# EAGLE design DigiCar (EAGLE 6.5.0)
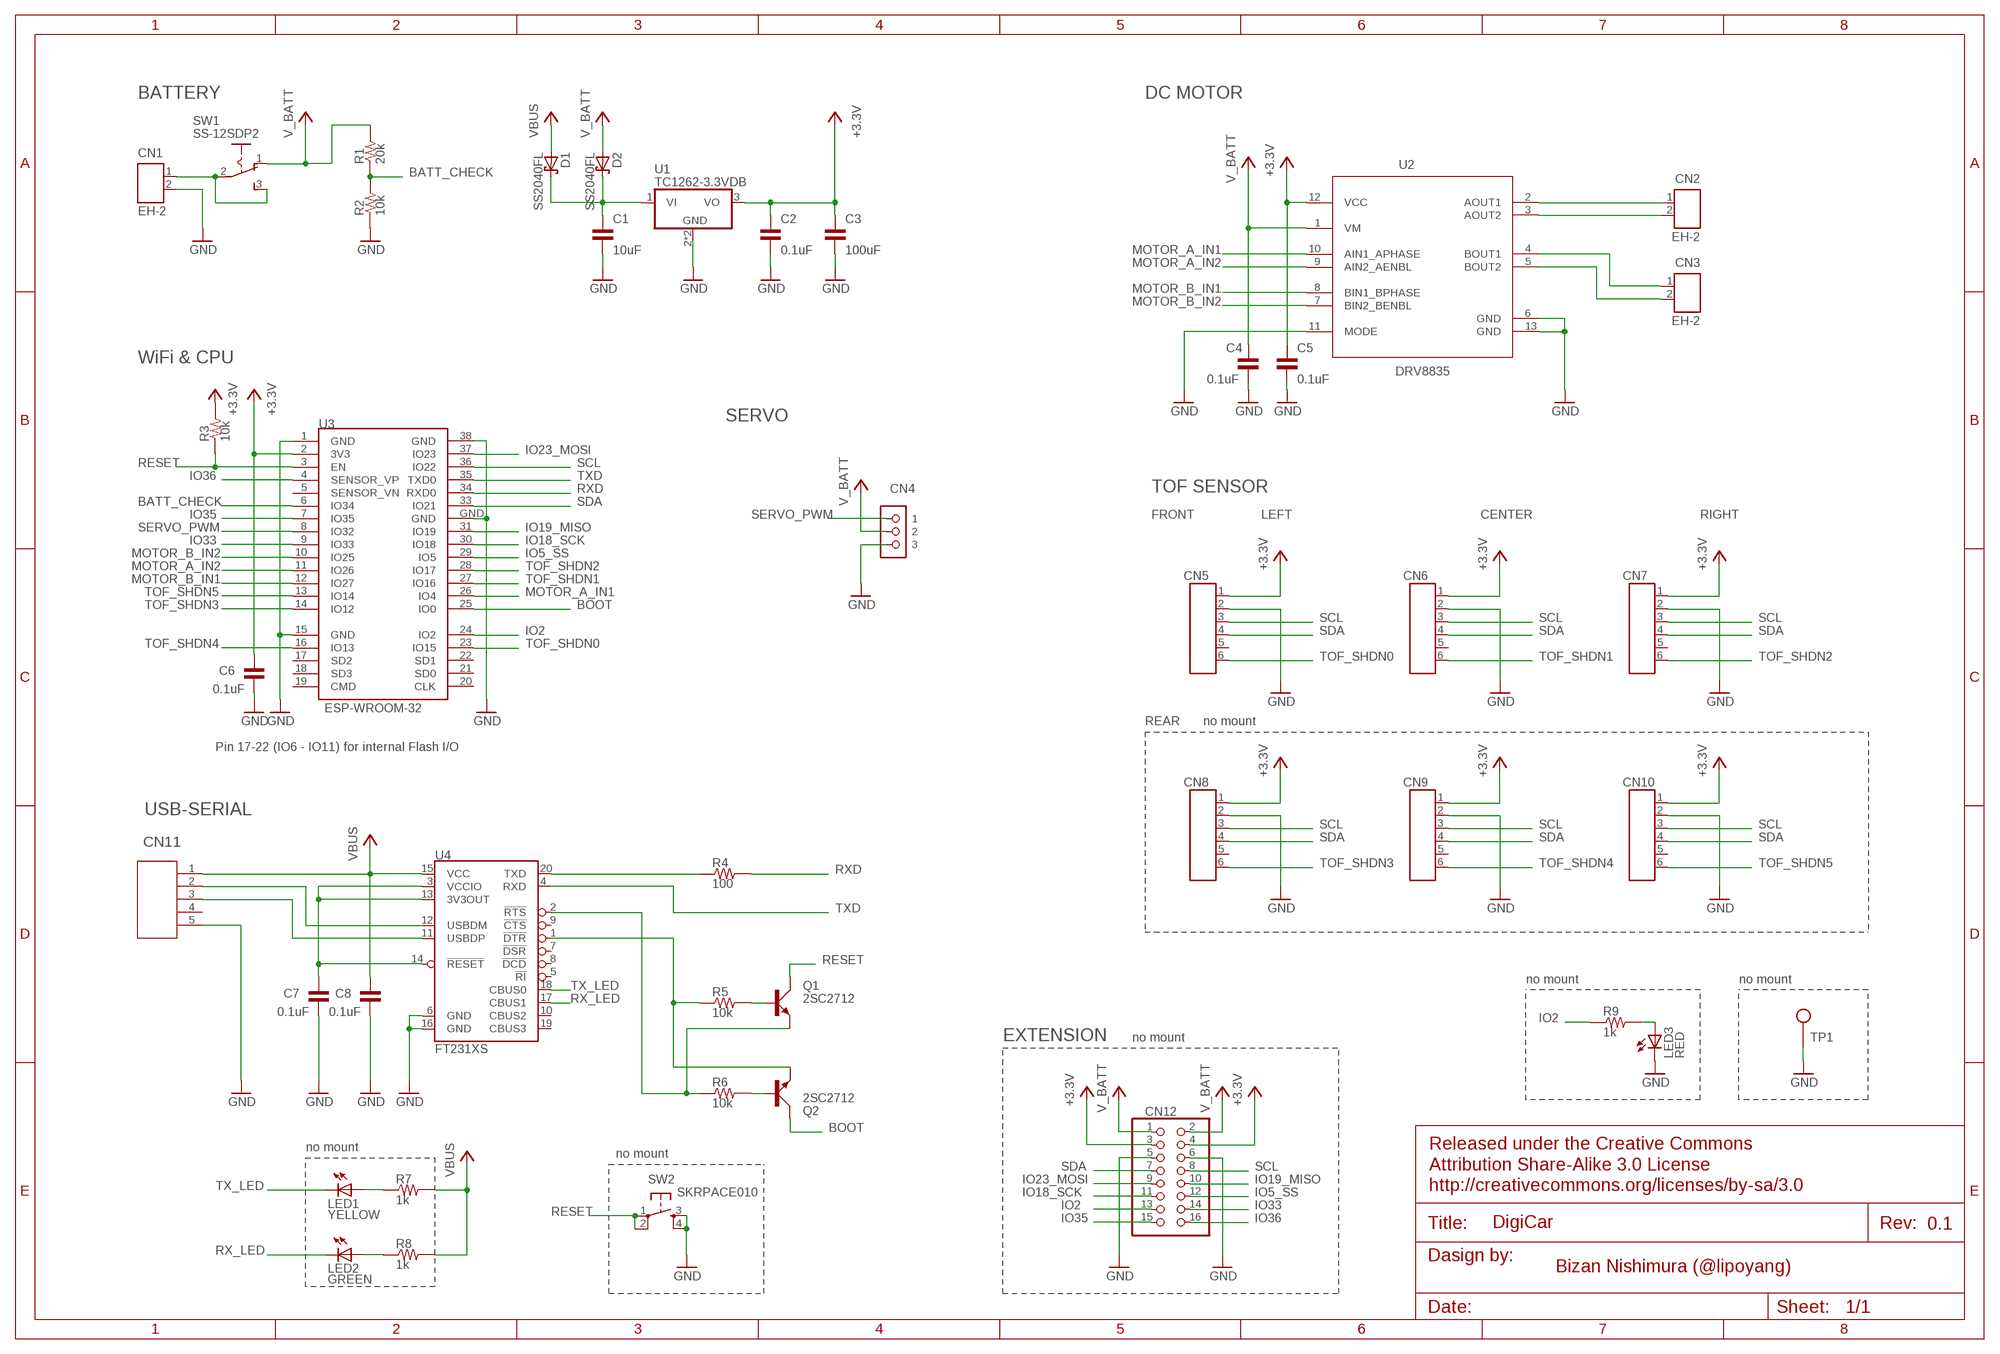
[diagram p0: schematic, sheet 1]

## Parts
C1  10uF  C-CP-3216  [CP3216]
C2  0.1uF  C-CP-1608  [CP1608]
C3  100uF  C-CP-3216  [CP3216]
C4  0.1uF  C-CP-1608  [CP1608]
C5  0.1uF  C-CP-1608  [CP1608]
C6  0.1uF  C-CP-1608  [CP1608]
C7  0.1uF  C-CP-1608  [CP1608]
C8  0.1uF  C-CP-1608  [CP1608]
CN1  EH-2  [EH-2]
CN2  EH-2  [EH-2]
CN3  EH-2  [EH-2]
CN4  PINHD-1X3  [CON_RC_SERVO]
CN5  PINHD-1X6  [1X06]
CN6  PINHD-1X6  [1X06]
CN7  PINHD-1X6  [1X06]
CN8  PINHD-1X6  [1X06]
CN9  PINHD-1X6  [1X06]
CN10  PINHD-1X6  [1X06]
CN11  ZX62-B-5PA(11)  [CONN_ZX62-B-5PA(11)_HIR]
CN12  PINHD-2X8  [2X08]
D1  SS2040FL  SCHOTTKY-DIODE-SOD123  [SOD123]
D2  SS2040FL  SCHOTTKY-DIODE-SOD123  [SOD123]
LED1  YELLOW  LED1608  [LED1608]
LED2  GREEN  LED1608  [LED1608]
LED3  RED  LED1608  [LED1608]
Q1  2SC2712  [SC59]
Q2  2SC2712  [SC59]
R1  20k  R-CP-1608  [CP1608]
R2  10k  R-CP-1608  [CP1608]
R3  10k  R-CP-1608  [CP1608]
R4  100  R-CP-1608  [CP1608]
R5  10k  R-CP-1608  [CP1608]
R6  10k  R-CP-1608  [CP1608]
R7  1k  R-CP-1608  [CP1608]
R8  1k  R-CP-1608  [CP1608]
R9  1k  R-CP-1608  [CP1608]
SW1  SS-12SDP2  M251  [SLIDE-SW]
SW2  SKRPACE010  [SKRPACE010]
TP1  TEST_PIN  [TEST_PIN]
U1  TC1262-3.3VDB  [SOT223]
U2  DRV8835  [DRV8835]
U3  ESP-WROOM-32  [ESP-WROOM-32]
U4  FT231XS  [SSOP20]

## Nets
+3V3: C2.SMD1(PIN1) C3.SMD1(PIN1) C5.SMD1(PIN1) C6.SMD1(PIN1) CN5.1 CN6.1 CN7.1 CN8.1 CN9.1 CN10.1 CN12.3 CN12.4 R3.SMD2(PIN2) U1.3(VO) U2.12(VCC) U3.2(3V3) ; supply symbol labelled +3.3V
BATT_CHECK: R1.SMD1(PIN1) R2.SMD2(PIN2) U3.6(IO34)
BOOT: Q2.C U3.25(IO0)
GND: C1.SMD2(PIN2) C2.SMD2(PIN2) C3.SMD2(PIN2) C4.SMD2(PIN2) C5.SMD2(PIN2) C6.SMD2(PIN2) C7.SMD2(PIN2) C8.SMD2(PIN2) CN1.2 CN4.3 CN5.2 CN6.2 CN7.2 CN8.2 CN9.2 CN10.2 CN11.5 CN12.5 CN12.6 LED3.C R2.SMD1(PIN1) SW2.3 SW2.4 TP1.1 U1.2(GND) U1.4(GND) U2.6(GND) U2.11(MODE) U2.13(GND) U3.1(GND) U3.15(GND) U3.38(GND) U3.GND U4.6(GND) U4.16(GND)
IO2: CN12.13 R9.SMD1(PIN1) U3.24(IO2)
IO5_SS: CN12.12 U3.29(IO5)
IO18_SCK: CN12.11 U3.30(IO18)
IO19_MISO: CN12.10 U3.31(IO19)
IO23_MOSI: CN12.9 U3.37(IO23)
IO33: CN12.14 U3.9(IO33)
IO35: CN12.15 U3.7(IO35)
IO36: CN12.16 U3.4(SENSOR_VP)
MOTOR_A_IN1: U2.10(AIN1_APHASE) U3.26(IO4)
MOTOR_A_IN2: U2.9(AIN2_AENBL) U3.11(IO26)
MOTOR_B_IN1: U2.8(BIN1_BPHASE) U3.12(IO27)
MOTOR_B_IN2: U2.7(BIN2_BENBL) U3.10(IO25)
N$1: CN1.1 SW1.2(P) SW1.3(S)
N$2: LED3.A R9.SMD2(PIN2)
N$3: C1.SMD1(PIN1) D1.C D2.C U1.1(VI)
N$7: R4.SMD1(PIN1) U4.20(TXD)
N$8: Q1.B R5.SMD2(PIN2)
N$12: Q2.B R6.SMD2(PIN2)
N$13: CN11.2 U4.12(USBDM)
N$14: CN11.3 U4.11(USBDP)
N$15: C7.SMD1(PIN1) U4.3(VCCIO) U4.13(3V3OUT) U4.14(!RESET)
N$16: Q2.E R5.SMD1(PIN1) U4.1(!DTR)
N$17: Q1.E R6.SMD1(PIN1) U4.2(!RTS)
N$18: CN2.1 U2.2(AOUT1)
N$19: CN2.2 U2.3(AOUT2)
N$20: LED1.A R7.SMD1(PIN1)
N$21: LED2.A R8.SMD1(PIN1)
N$22: CN3.1 U2.4(BOUT1)
N$23: CN3.2 U2.5(BOUT2)
RESET: Q1.C R3.SMD1(PIN1) SW2.1 SW2.2 U3.3(EN)
RX_LED: LED2.C U4.17(CBUS1)
RXD: R4.SMD2(PIN2) U3.34(RXD0)
SCL: CN5.3 CN6.3 CN7.3 CN8.3 CN9.3 CN10.3 CN12.8 U3.36(IO22)
SDA: CN5.4 CN6.4 CN7.4 CN8.4 CN9.4 CN10.4 CN12.7 U3.33(IO21)
SERVO_PWM: CN4.1 U3.8(IO32)
TOF_SHDN0: CN5.6 U3.23(IO15)
TOF_SHDN1: CN6.6 U3.27(IO16)
TOF_SHDN2: CN7.6 U3.28(IO17)
TOF_SHDN3: CN8.6 U3.14(IO12)
TOF_SHDN4: CN9.6 U3.16(IO13)
TOF_SHDN5: CN10.6 U3.13(IO14)
TX_LED: LED1.C U4.18(CBUS0)
TXD: U3.35(TXD0) U4.4(RXD)
V_BATT: C4.SMD1(PIN1) CN4.2 CN12.1 CN12.2 D2.A R1.SMD2(PIN2) SW1.1(O) U2.1(VM)
VBUS: C8.SMD1(PIN1) CN11.1 D1.A R7.SMD2(PIN2) R8.SMD2(PIN2) U4.15(VCC)
Unconnected: CN5.5 CN6.5 CN7.5 CN8.5 CN9.5 CN10.5 CN11.4 U3.5(SENSOR_VN) U3.17(SD2) U3.18(SD3) U3.19(CMD) U3.20(CLK) U3.21(SD0) U3.22(SD1) U4.5(!RI) U4.7(!DSR) U4.8(!DCD) U4.9(!CTS) U4.10(CBUS2) U4.19(CBUS3)

## Notes on the sheet
- BATTERY | DC MOTOR
- WiFi & CPU
- SERVO
- TOF SENSOR
- FRONT | LEFT | CENTER | RIGHT
- REAR | no mount
- Pin 17-22 (IO6 - IO11) for internal Flash I/O
- USB-SERIAL
- no mount | no mount
- EXTENSION | no mount
- no mount
- no mount
- 0.1
- Bizan Nishimura (@lipoyang)

## Library data of the parts
C1-C8 = lipoyang_cr:C-: CAPACITOR Japanese symbol
CN1-CN3 = lipoyang_mechanical:EH-2
CN4 = lipoyang_mechanical:PINHD-1X3: PIN HEADER
CN5-CN10 = lipoyang_mechanical:PINHD-1X6: PIN HEADER
CN11 = lipoyang_mechanical:ZX62-B-5PA(11); BUILT_BY: EMA_Cory; COPYRIGHT: Copyright (C) 2018 Accelerated Designs. All rights reserved; DATASHEET: https://media.digikey.com/pdf/Data%20Sheets/Hirose%20PDFs/ZX_Series.pdf; MANUFACTURER_PART_NUMBER: ZX62-B-5PA(11); SOURCELIBRARY: Hirose_2020-05-21; VENDOR: Hirose
CN12 = lipoyang_mechanical:PINHD-2X8: PIN HEADER
D1 D2 = lipoyang_discrete:SCHOTTKY-DIODE: Schottky Diode
LED1-LED3 = lipoyang_discrete:LED: LED
Q1 Q2 = lipoyang_discrete:2SC2712: High-Frequency Amplifier Transistor 11V, 50mA, 3.2GHz (Rohm)
R1-R9 = lipoyang_cr:R-: RESISTOR Japanese symbol
SW1 = lipoyang_mechanical:M251: SLIDING SWITCH Mors, distributor Buerklin, 11G702
SW2 = lipoyang_mechanical:SKRPACE010
TP1 = lipoyang:TEST_PIN: Test Pin
U1 = lipoyang_ic:TC1262-3.3VDB: Positive VOLTAGE REGULATOR Source: http://cache.national.com/ds/LM/LM340.pdf
U2 = lipoyang_ic:DRV8835; MANUFACTURER: Texas Instruments; PARTNUMBER: DRV8835DSSR; REFDES: RefDes; TYPE: TYPE
U3 = lipoyang_rf:ESP-WROOM-32: Espressif Systems ESP-WROOM-32
U4 = lipoyang_ic:FT231XS: FTDI FT231X Full Speed USB to Full-handshake UART This USB2.0 Full Speed IC offers a compact bridge to full handshake UART interfaces. The device is a UART, capable of operating up to 3MBaud, with low power consumption (8mA). The FT231X includes the complete FT-X series feature set and enables USB to be added into a system design quickly and easily over a UART interface. See: http://www.ftdichip.com/Products/ICs/FT231X.html

## Net classes
0 default: width 0.203 mm
1 vcc: width 0.254 mm

## Board
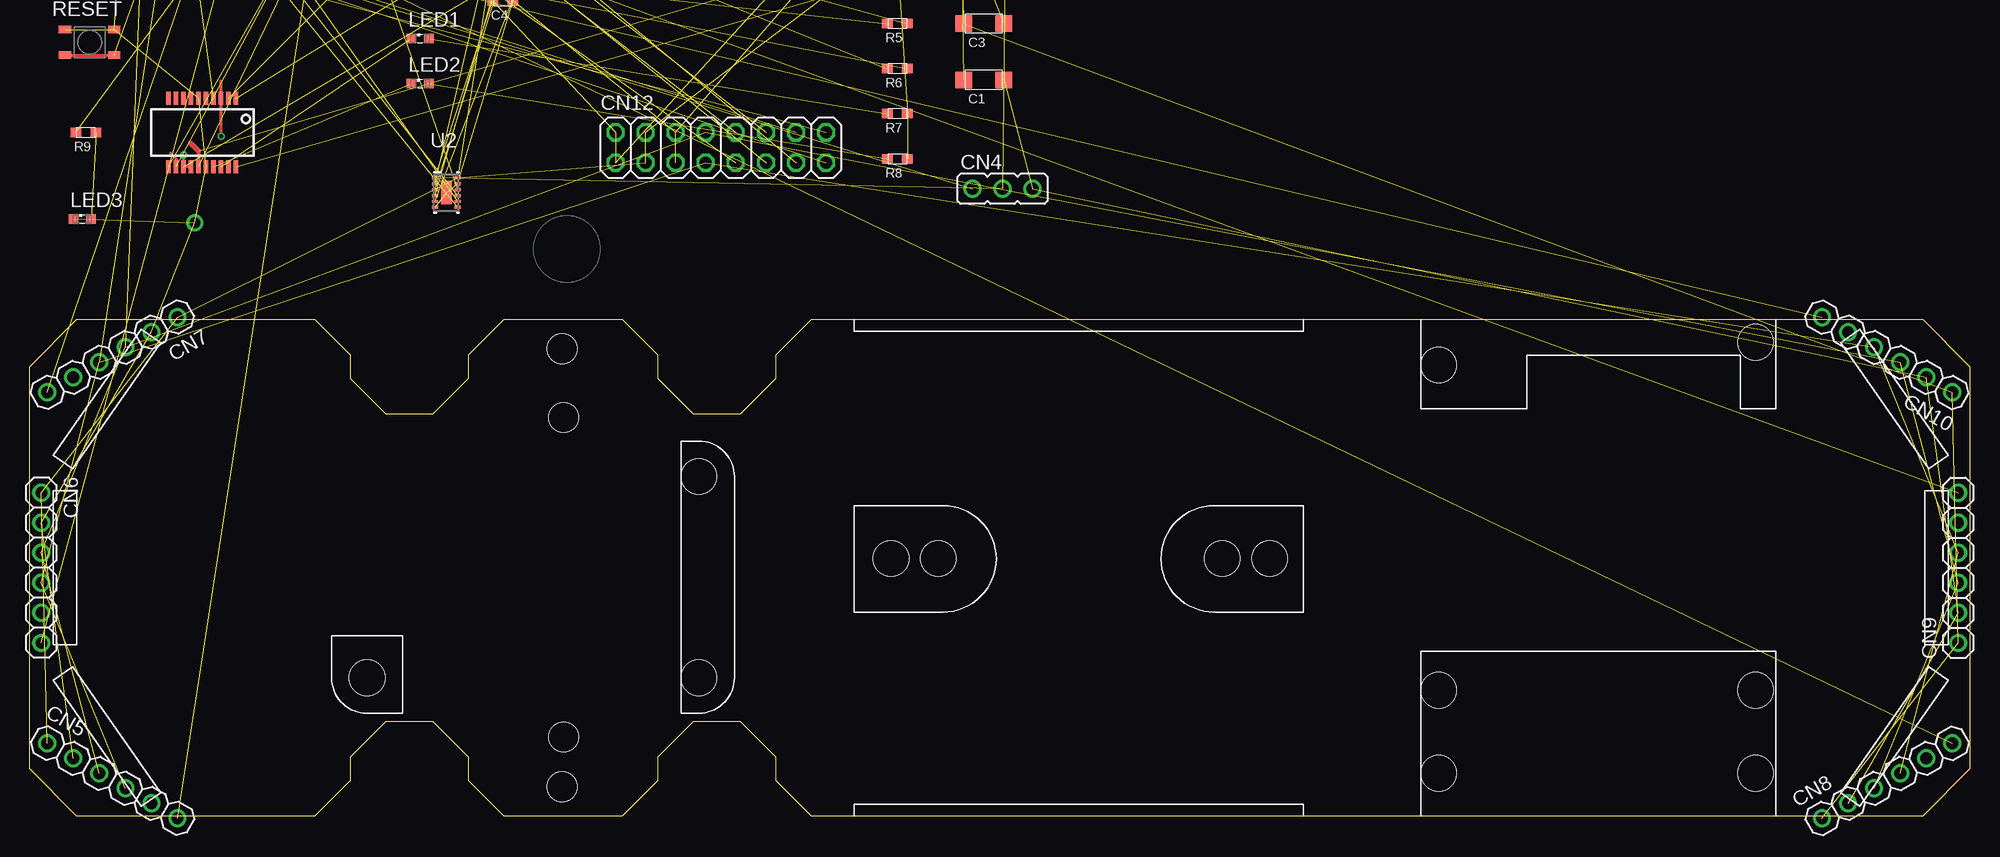
[diagram p1: board, top side]
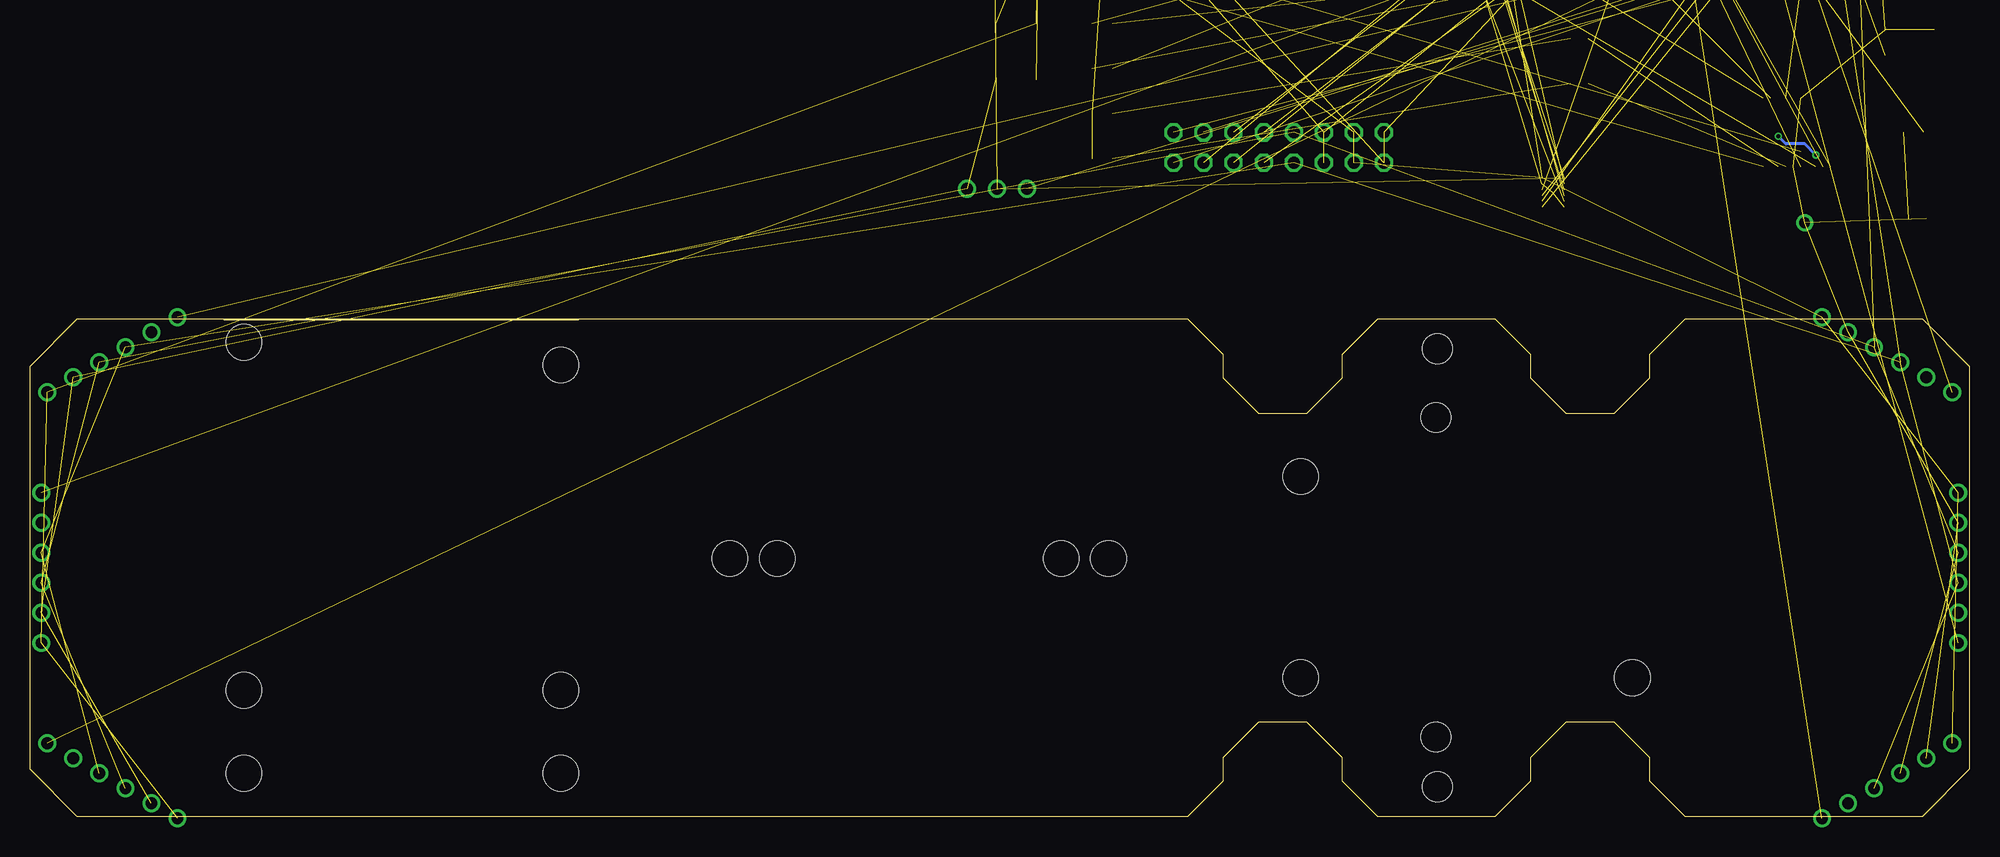
[diagram p2: board, bottom side, seen from below]

Size 164 x 42 mm. Coordinates in mm from the lower left corner, seen from the top.
Outline: 147.59,41.95 117.59,41.95
Outline: 145.92,0 160,0 164,4 164,38 160,42 66.1,42 63.1,39 63.1,37 60.1,34 56.1,34 53.1,37 53.1,39 50.1,42 40.1,42 37.1,39 37.1,37 34.1,34 30.1,34 27.1,37 27.1,39 24.1,42 12.26,42
Outline: 145.92,0 145.92,0
Outline: 145.92,0 113.33,0
Outline: 113.33,0 113.33,0
Outline: 113.33,0 66.1,0 63.1,3 63.1,5 60.1,8 56.1,8 53.1,5 53.1,3 50.1,0 40.1,0 37.1,3 37.1,5 34.1,8 30.1,8 27.1,5 27.1,3 24.1,0 12.26,0
Outline: 12.26,0 12.26,0
Outline: 12.26,0 4,0 0,4 0,38 4,42 12.26,42
Outline: 12.26,42 12.26,42
Copper layers (1*16): Top 0.035mm / dielectric 1.5mm / Bottom 0.035mm
Design rules "SeeedStudio_2layer_DRU_no_angle_20140221_lipoyang": minimum track width 8mil, minimum drill 12mil, track to track 8mil, track to pad 8mil, pad to pad 8mil, via to via 8mil, smd to smd 0mil, copper to edge 10mil, drill to drill 10mil, minimum pad ring 10mil, minimum via ring 6mil, stop-mask expansion 2mil, vias tented up to drill 100mil, thermal gap 10mil
Holes 3 mm at 28.53,11.71 56.57,11.71 56.57,28.71 72.81,21.77 76.81,21.77 100.81,21.77 104.81,21.77 119.09,38.15 145.88,40.06 119.09,10.65 119.09,3.65 145.88,10.65 145.88,3.65
Holes 2.5 mm at 45,2.5 45.13,6.71 45,39.5 45.13,33.71

### Footprints (pad centres in the part's own frame; a part is rotated, then mirrored left to right if it is on the bottom)
CP3216 = smd 1.4 x 1.4: SMD1 -1.7,0; SMD2 1.7,0
CP1608 = smd 0.9 x 0.8: SMD1 -0.85,0; SMD2 0.85,0
EH-2 = drill 0.9: 1 -1.27,0; 2 1.27,0
CON_RC_SERVO = drill 1.016: 1 -2.54,0; 2 0,0; 3 2.54,0
1X06 = drill 1: 1 -6.35,0; 2 -3.81,0; 3 -1.27,0; 4 1.27,0; 5 3.81,0; 6 6.35,0
CONN_ZX62-B-5PA(11)_HIR = smd 0.406 x 1.346: 1 -1.3,2.619; 2 -0.65,2.619; 3 0,2.619; 4 0.65,2.619; 5 1.3,2.619 | smd 1.905 x 1.803: 6 -4,-0.056; 7 4,-0.056 | smd 1.905 x 1.905: 8 -1.2,-0.056; 9 1.2,-0.056 | smd 1.6 x 2.108: 10 -3.1,2.494; 11 3.1,2.494
2X08 = drill 1.016 octagon: 1 -8.89,-1.27; 2 -8.89,1.27; 3 -6.35,-1.27; 4 -6.35,1.27; 5 -3.81,-1.27; 6 -3.81,1.27; 7 -1.27,-1.27; 8 -1.27,1.27; 9 1.27,-1.27; 10 1.27,1.27; 11 3.81,-1.27; 12 3.81,1.27; 13 6.35,-1.27; 14 6.35,1.27; 15 8.89,-1.27; 16 8.89,1.27
SOD123 = smd 1.4 x 1.4: A 1.9,0; C -1.9,0
LED1608 = smd 0.8 x 0.8: A 0.75,0; C -0.75,0
SC59 = smd 0.8 x 1: B -0.95,-1.2; C 0,1.2; E 0.95,-1.2
SLIDE-SW = drill 0.9: 1 -2.54,0; 2 0,0; 3 2.54,0
SKRPACE010 = smd 1.05 x 0.65: 1 -2.075,1.075; 2 2.075,1.075; 3 -2.075,-1.075; 4 2.075,-1.075
TEST_PIN = drill 0.914: 1 0,0
SOT223 = smd 1.219 x 2.235: 1 -2.311,-3.099; 2 0,-3.099; 3 2.311,-3.099 | smd 3.6 x 2.2: 4 0,3.099
DRV8835 = smd 0.5 x 0.25: 1 -0.95,1.25; 2 -0.95,0.75; 3 -0.95,0.25; 4 -0.95,-0.25; 5 -0.95,-0.75; 6 -0.95,-1.25; 7 0.95,-1.25; 8 0.95,-0.75; 9 0.95,-0.25; 10 0.95,0.25; 11 0.95,0.75; 12 0.95,1.25 | smd 0.9 x 2: 13 0,0
ESP-WROOM-32 = smd 1.5 x 1: 1 -9.25,7; 2 -9.25,5.73; 3 -9.25,4.46; 4 -9.25,3.19; 5 -9.25,1.92; 6 -9.25,0.65; 7 -9.25,-0.62; 8 -9.25,-1.89; 9 -9.25,-3.16; 10 -9.25,-4.43; 11 -9.25,-5.7; 12 -9.25,-6.97; 13 -9.25,-8.24; 14 -9.25,-9.51; 25 9.25,-9.51; 26 9.25,-8.24; 27 9.25,-6.97; 28 9.25,-5.7; 29 9.25,-4.43; 30 9.25,-3.16; 31 9.25,-1.89; 32 9.25,-0.62; 33 9.25,0.65; 34 9.25,1.92; 35 9.25,3.19; 36 9.25,4.46; 37 9.25,5.73; 38 9.25,7 | smd 1 x 1.5: 15 -5.7,-11.25; 16 -4.43,-11.25; 17 -3.16,-11.25; 18 -1.89,-11.25; 19 -0.62,-11.25; 20 0.65,-11.25; 21 1.92,-11.25; 22 3.19,-11.25; 23 4.46,-11.25; 24 5.73,-11.25 | smd 4 x 4: GND -1.03,-0.34
SSOP20 = smd 0.381 x 1.093: 1 -2.857,-2.88; 2 -2.223,-2.88; 3 -1.587,-2.88; 4 -0.953,-2.88; 5 -0.318,-2.88; 6 0.318,-2.88; 7 0.953,-2.88; 8 1.587,-2.88; 9 2.223,-2.88; 10 2.857,-2.88; 11 2.857,2.88; 12 2.223,2.88; 13 1.587,2.88; 14 0.953,2.88; 15 0.318,2.88; 16 -0.318,2.88; 17 -0.953,2.88; 18 -1.587,2.88; 19 -2.223,2.88; 20 -2.857,2.88

### Placement (x,y rotation side)
C1  80.64,62.23 0 top  (outside the outline)
C2  79.69,71.44 0 top  (outside the outline)
C3  80.64,66.99 0 top  (outside the outline)
C4  40.01,68.9 0 top  (outside the outline)
C5  40.01,72.71 0 top  (outside the outline)
C6  73.34,93.66 0 top  (outside the outline)
C7  73.34,89.85 0 top  (outside the outline)
C8  73.34,86.04 0 top  (outside the outline)
CN1  89.53,83.82 0 top  (outside the outline)
CN2  42.55,83.5 0 top  (outside the outline)
CN3  42.55,76.84 0 top  (outside the outline)
CN4  82.23,53.02 0 top  (outside the outline)
CN5  7,3 330 top
CN6  1,21 270 top
CN7  7,39 210 top
CN8  157,3 30 top
CN9  163,21 90 top
CN10  157,39 150 top
CN11  36.51,95.89 0 top  (outside the outline)
CN12  58.42,56.52 0 top  (outside the outline)
D1  80.64,76.2 0 top  (outside the outline)
D2  80.64,79.38 0 top  (outside the outline)
LED1  33.02,65.72 0 top  (outside the outline)
LED2  33.02,61.91 0 top  (outside the outline)
LED3  4.45,50.48 0 top  (outside the outline)
Q1  33.66,79.69 0 top  (outside the outline)
Q2  33.66,72.39 0 top  (outside the outline)
R1  73.34,82.23 0 top  (outside the outline)
R2  73.34,78.42 0 top  (outside the outline)
R3  73.34,74.61 0 top  (outside the outline)
R4  73.34,70.8 0 top  (outside the outline)
R5  73.34,66.99 0 top  (outside the outline)
R6  73.34,63.18 0 top  (outside the outline)
R7  73.34,59.37 0 top  (outside the outline)
R8  73.34,55.56 0 top  (outside the outline)
R9  4.76,57.79 0 top  (outside the outline)
SW1  90.81,90.17 0 top  (outside the outline)
SW2  5.08,65.41 180 top  (outside the outline)
TP1  13.97,50.17 0 top  (outside the outline)
U1  81.28,86.04 0 top  (outside the outline)
U2  35.24,52.71 0 top  (outside the outline)
U3  14.61,81.92 90 top  (outside the outline)
U4  14.61,57.79 180 top  (outside the outline)

### Tracks (layer width: path | path; a pad name or v marks a point on that pad's centre or on a via)
+3V3  (15 unrouted)
BATT_CHECK  (2 unrouted)
BOOT  (1 unrouted)
GND  (34 unrouted)
IO2  (2 unrouted)
IO5_SS  (1 unrouted)
IO18_SCK  (1 unrouted)
IO19_MISO  (1 unrouted)
IO23_MOSI  (1 unrouted)
IO33  (1 unrouted)
IO35  (1 unrouted)
IO36  (1 unrouted)
MOTOR_A_IN1  (1 unrouted)
MOTOR_A_IN2  (1 unrouted)
MOTOR_B_IN1  (1 unrouted)
MOTOR_B_IN2  (1 unrouted)
N$1  (2 unrouted)
N$2  (1 unrouted)
N$3  (3 unrouted)
N$7  (1 unrouted)
N$8  (1 unrouted)
N$12  (1 unrouted)
N$13  (1 unrouted)
  Top 0.254: 11.9,56.05 12.38,55.56 U4.12
N$14  (1 unrouted)
N$15  (via drill 0.3)  (1 unrouted)
  Top 0.254: 16.19,62.13 U4.3 v16.19,57.47 | v13.02,55.88 U4.13 U4.14
  Bottom 0.254: v13.02,55.88 13.97,56.83 15.56,56.83 v16.19,57.47
N$16  (2 unrouted)
N$17  (2 unrouted)
N$18  (1 unrouted)
N$19  (1 unrouted)
N$20  (1 unrouted)
N$21  (1 unrouted)
N$22  (1 unrouted)
N$23  (1 unrouted)
RESET  (3 unrouted)
  Top 0.254: SW2.2 SW2.1
RX_LED  (1 unrouted)
RXD  (1 unrouted)
SCL  (7 unrouted)
SDA  (7 unrouted)
SERVO_PWM  (1 unrouted)
TOF_SHDN0  (1 unrouted)
TOF_SHDN1  (1 unrouted)
TOF_SHDN2  (1 unrouted)
TOF_SHDN3  (1 unrouted)
TOF_SHDN4  (1 unrouted)
TOF_SHDN5  (1 unrouted)
TX_LED  (1 unrouted)
TXD  (1 unrouted)
V_BATT  (7 unrouted)
VBUS  (5 unrouted)
  Top 0.305: 14.29,56.2 U4.15
  Top 0.406: 13.64,56.85 14.29,56.2

### Text on the board
tPlace: RESET